# Altium project TestBoard.PrjPcb (part 3 of 5)
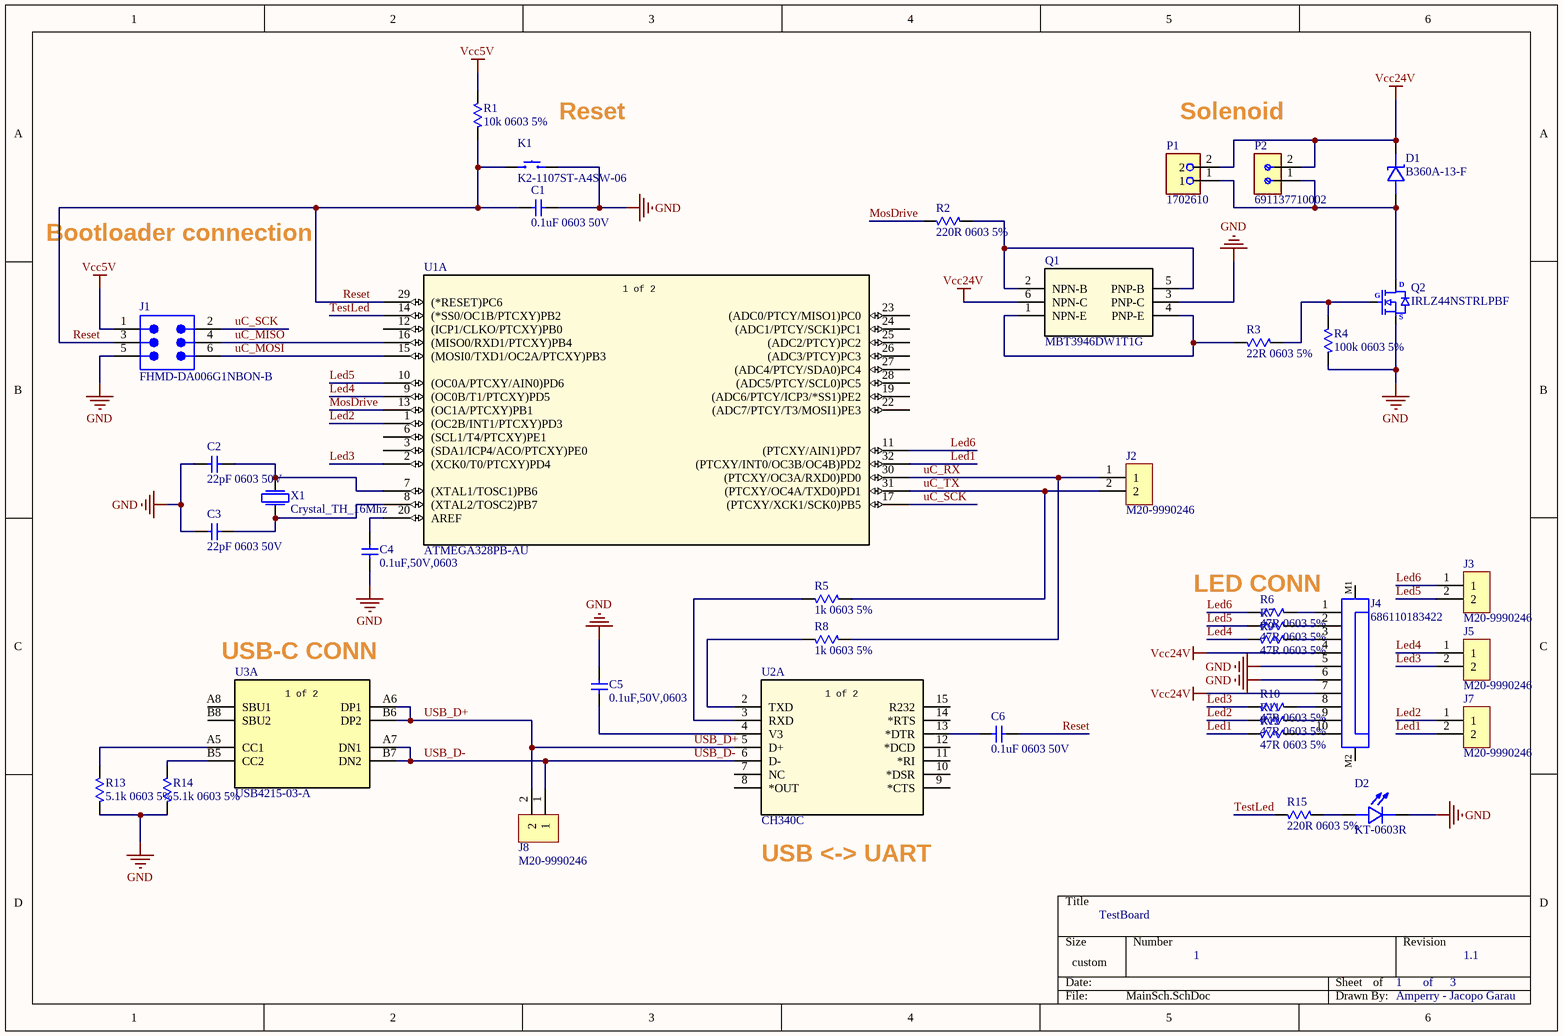
[diagram p4: MainSch.SchDoc]

## Sheet MainSch.SchDoc: TestBoard (continued)

### Library data of the parts (continued)
R4 = CMP-009-00184-2: 100k Ohm 0603 5% Chip Resistor SMD; Manufacturer Part Number: RC0603FR-07100KL; Manufacturer: Yageo Group; Voltage Rating: 75V; Voltage Rating (DC): 50V; Value: 100kO; Temperature Coefficient: 100ppm/°C; Tolerance: 1%; Power Rating: 100mW; ComponentLink12Description: https://datasheet.octopart.com:443/RC0603FR-07100KL-Yageo-Group-datasheet-176638170.pdf?src-supplier=Future+Electronics; ComponentLink6Description: https://datasheet.octopart.com:443/RC0603FR-07100KL-Yageo-datasheet-141265859.pdf?src-supplier=Upverter; ComponentLink2URL: https://datasheet.octopart.com:443/RC0603FR-07100KL-Yageo-datasheet-12596169.pdf?src-supplier=Newark; ComponentLink20Description: https://datasheet.octopart.com:443/RC0603FR-07100KL-Yageo-datasheet-30459151.pdf?src-supplier=Seeed+Studio; Component Type: Standard; China RoHS: Non-Compliant; Length: 1.6mm; ComponentLink5URL: https://datasheet.octopart.com:443/RC0603FR-07100KL-Yageo-datasheet-17842380.pdf?src-supplier=element14+APAC; Design Item ID: RC0603FR-07100KL; ComponentLink21Description: https://datasheet.octopart.com:443/RC0603FR-07100KL-Yageo-datasheet-118562.pdf?src-supplier=DigiKey; ComponentLink15Description: https://datasheet.octopart.com:443/RC0603FR-07100KL-Yageo-datasheet-27584510.pdf?src-supplier=Future+Electronics; ComponentLink11Description: https://datasheet.octopart.com:443/RC0603FR-07100KL-Yageo-datasheet-13691069.pdf?src-supplier=Farnell; Depth: 800µm; ComponentLink11URL: https://datasheet.octopart.com:443/RC0603FR-07100KL-Yageo-datasheet-13691069.pdf?src-supplier=Farnell; ComponentLink13Description: https://datasheet.octopart.com:443/RC0603FR-07100KL-Yageo-datasheet-164759695.pdf?src-supplier=Future+Electronics; Harmonized Tariff Schedule (HTS) Code: 8533.21.00.30; ComponentLink1Description: https://datasheet.octopart.com:443/RC0603FR-07100KL-Yageo-datasheet-175887523.pdf?src-supplier=Newark; Radiation Hardening: No; ComponentLink24URL: http://sigma.octopart.com:80/rohs_statement/Yageo-company-2.pdf?src-supplier=Compliance+Statements; ComponentLink10URL: https://datasheet.octopart.com:443/RC0603FR-07100KL-Yageo-datasheet-62067350.pdf?src-supplier=Farnell; ComponentLink6URL: https://datasheet.octopart.com:443/RC0603FR-07100KL-Yageo-datasheet-141265859.pdf?src-supplier=Upverter; ComponentLink8URL: https://sigma.octopart.com:443/138820526/technical_drawing/Yageo-RC0603FR-07100KL.pdf?src-supplier=Upverter; Composition: Thick Film; Packaging: Tape & Reel; ComponentLink9URL: https://datasheet.octopart.com:443/RC0603FR-07100KL-Yageo-datasheet-98239111.pdf?src-supplier=Upverter; Working Voltage: 75V; ComponentLink19URL: https://datasheet.octopart.com/RC0603FR-07100KL-Yageo-datasheet-73766026.pdf; Number of Terminations: 2; Lifecycle Status: Production; ComponentLink3Description: https://datasheet.octopart.com:443/RC0603FR-07100KL-Yageo-datasheet-34211833.pdf?src-supplier=Newark; JLCPCB Part Number: C14675; Military Standard: Not; ComponentLink23URL: http://sigma.octopart.com:80/conflict_mineral_statement/Yageo-company-3.pdf?src-supplier=Compliance+Statements; Termination: SMD/SMT; ComponentLink24Description: http://sigma.octopart.com:80/rohs_statement/Yageo-company-2.pdf?src-supplier=Compliance+Statements; Mounting Technology: Surface Mount; ComponentLink21URL: https://datasheet.octopart.com:443/RC0603FR-07100KL-Yageo-datasheet-118562.pdf?src-supplier=DigiKey; ComponentLink17URL: https://datasheet.octopart.com:443/RC0603FR-07100KL-Yageo-datasheet-8324193.pdf?src-supplier=Future+Electronics; ComponentLink16Description: https://datasheet.octopart.com:443/RC0603FR-07100KL-Yageo-datasheet-15599030.pdf?src-supplier=Future+Electronics; Pins: 2; ComponentLink18URL: https://datasheet.octopart.com:443/RC0603FR-07100KL-Yageo-datasheet-79472498.pdf?src-supplier=Megastar; Export Control Classification Number (ECCN) Code: EAR99; ComponentLink19Description: https://datasheet.octopart.com/RC0603FR-07100KL-Yageo-datasheet-73766026.pdf; ComponentLink10Description: https://datasheet.octopart.com:443/RC0603FR-07100KL-Yageo-datasheet-62067350.pdf?src-supplier=Farnell; ComponentLink3URL: https://datasheet.octopart.com:443/RC0603FR-07100KL-Yageo-datasheet-34211833.pdf?src-supplier=Newark; Introduction Date: 2004-09-22; Country of Origin: Mainland China, Taiwan; Pin Count: 2; Height: 450µm; ComponentLink8Description: https://sigma.octopart.com:443/138820526/technical_drawing/Yageo-RC0603FR-07100KL.pdf?src-supplier=Upverter; ComponentLink7URL: https://datasheet.octopart.com:443/RC0603FR-07100KL-Yageo-datasheet-103092701.pdf?src-supplier=Upverter; Width: 800µm; ComponentLink18Description: https://datasheet.octopart.com:443/RC0603FR-07100KL-Yageo-datasheet-79472498.pdf?src-supplier=Megastar; Max Operating Temperature: 155°C; RoHS: Compliant; Case Code (Imperial): 0603; ComponentLink13URL: https://datasheet.octopart.com:443/RC0603FR-07100KL-Yageo-datasheet-164759695.pdf?src-supplier=Future+Electronics; ComponentLink1URL: https://datasheet.octopart.com:443/RC0603FR-07100KL-Yageo-datasheet-175887523.pdf?src-supplier=Newark; Number of Terminals: 2; REACH SVHC: Yes; ComponentLink12URL: https://datasheet.octopart.com:443/RC0603FR-07100KL-Yageo-Group-datasheet-176638170.pdf?src-supplier=Future+Electronics; ComponentLink14URL: https://datasheet.octopart.com:443/RC0603FR-07100KL-Yageo-datasheet-137700087.pdf?src-supplier=Future+Electronics; Category: Chip SMD Resistors; ComponentLink4URL: https://datasheet.octopart.com:443/RC0603FR-07100KL-Yageo-datasheet-8328172.pdf?src-supplier=element14+APAC; ComponentLink23Description: http://sigma.octopart.com:80/conflict_mineral_statement/Yageo-company-3.pdf?src-supplier=Compliance+Statements; ComponentLink20URL: https://datasheet.octopart.com:443/RC0603FR-07100KL-Yageo-datasheet-30459151.pdf?src-supplier=Seeed+Studio; Lead Free: Lead Free; ComponentLink16URL: https://datasheet.octopart.com:443/RC0603FR-07100KL-Yageo-datasheet-15599030.pdf?src-supplier=Future+Electronics; ComponentLink14Description: https://datasheet.octopart.com:443/RC0603FR-07100KL-Yageo-datasheet-137700087.pdf?src-supplier=Future+Electronics; Contact Plating: Tin; Source: MySchLib.SchLib; ComponentLink22URL: https://datasheet.octopart.com:443/RC0603FR-07100KL-Yageo-datasheet-503470.pdf?src-supplier=element14; ComponentLink5Description: https://datasheet.octopart.com:443/RC0603FR-07100KL-Yageo-datasheet-17842380.pdf?src-supplier=element14+APAC; ComponentLink7Description: https://datasheet.octopart.com:443/RC0603FR-07100KL-Yageo-datasheet-103092701.pdf?src-supplier=Upverter; ComponentLink4Description: https://datasheet.octopart.com:443/RC0603FR-07100KL-Yageo-datasheet-8328172.pdf?src-supplier=element14+APAC; ComponentLink17Description: https://datasheet.octopart.com:443/RC0603FR-07100KL-Yageo-datasheet-8324193.pdf?src-supplier=Future+Electronics; Min Operating Temperature: -55°C; ComponentLink2Description: https://datasheet.octopart.com:443/RC0603FR-07100KL-Yageo-datasheet-12596169.pdf?src-supplier=Newark; Pricing: 1=0.1, 10=0.024, 25=0.0172, 50=0.0138, 100=0.0112, 250=0.0086, 500=0.00716, 1000=0.00603 (USD); ComponentLink9Description: https://datasheet.octopart.com:443/RC0603FR-07100KL-Yageo-datasheet-98239111.pdf?src-supplier=Upverter; ComponentLink15URL: https://datasheet.octopart.com:443/RC0603FR-07100KL-Yageo-datasheet-27584510.pdf?src-supplier=Future+Electronics; Case/Package: 0603; Case Code (Metric): 0603; Stock: 5166205; ComponentLink22Description: https://datasheet.octopart.com:443/RC0603FR-07100KL-Yageo-datasheet-503470.pdf?src-supplier=element14; Schedule B: 8533210045, 8533210045
R5 R8 = CMP-009-00185-2: 1k 0603 5% Chip Resistor SMD; Manufacturer: Yageo Group; Manufacturer Part Number: RC0603JR-071KL; Power Rating: 100mW; Temperature Coefficient: 100ppm/°C; Value: 1kO; Working Voltage: 75V; Voltage Rating (AC): 50V; ComponentLink6URL: https://datasheet.octopart.com:443/RC0603JR-071KL-Yageo-Group-datasheet-176638170.pdf?src-supplier=Future+Electronics; REACH SVHC: Yes; Source: MySchLib.SchLib; Case/Package: 0603; ComponentLink11URL: https://datasheet.octopart.com:443/RC0603JR-071KL-Yageo-datasheet-15599030.pdf?src-supplier=Future+Electronics; ComponentLink15Description: https://datasheet.octopart.com:443/RC0603JR-071KL-Yageo-datasheet-118562.pdf?src-supplier=DigiKey; ComponentLink7Description: https://datasheet.octopart.com:443/RC0603JR-071KL-Yageo-datasheet-164759695.pdf?src-supplier=Future+Electronics; China RoHS: Non-Compliant; Number of Terminals: 2; Category: Chip SMD Resistors; Component Type: Standard; Min Operating Temperature: -55°C; Packaging: Cut Tape; ComponentLink3Description: https://datasheet.octopart.com:443/RC0603JR-071KL-Yageo-datasheet-8328172.pdf?src-supplier=Upverter; ComponentLink1Description: https://datasheet.octopart.com:443/RC0603JR-071KL-Yageo-datasheet-175887523.pdf?src-supplier=Newark; Pricing: 1=0.1, 10=0.022, 25=0.0156, 50=0.0124, 100=0.010, 250=0.00764, 500=0.00632, 1000=0.00529 (USD); Design Item ID: RC0603JR-071KL; JLCPCB Part Number: C14676; Contact Plating: Tin; ComponentLink8URL: https://datasheet.octopart.com:443/RC0603JR-071KL-Yageo-datasheet-137700087.pdf?src-supplier=Future+Electronics; Mounting Technology: Surface Mount; ComponentLink17URL: http://sigma.octopart.com:80/rohs_statement/Yageo-company-2.pdf?src-supplier=Compliance+Statements; ComponentLink2Description: https://datasheet.octopart.com:443/RC0603JR-071KL-Yageo-datasheet-34211833.pdf?src-supplier=Newark; ComponentLink5URL: https://datasheet.octopart.com:443/RC0603JR-071KL-Yageo-datasheet-62067350.pdf?src-supplier=element14+APAC; ComponentLink4URL: https://datasheet.octopart.com:443/RC0603JR-071KL-Yageo-datasheet-68297981.pdf?src-supplier=Upverter; Tolerance: 5%; Composition: Thick Film; ComponentLink7URL: https://datasheet.octopart.com:443/RC0603JR-071KL-Yageo-datasheet-164759695.pdf?src-supplier=Future+Electronics; ComponentLink8Description: https://datasheet.octopart.com:443/RC0603JR-071KL-Yageo-datasheet-137700087.pdf?src-supplier=Future+Electronics; ComponentLink9Description: https://datasheet.octopart.com:443/RC0603JR071KL-Yageo-datasheet-27584510.pdf?src-supplier=Future+Electronics; ComponentLink12Description: https://datasheet.octopart.com:443/RC0603JR-071KL-Yageo-datasheet-12596169.pdf?src-supplier=Future+Electronics; ComponentLink9URL: https://datasheet.octopart.com:443/RC0603JR071KL-Yageo-datasheet-27584510.pdf?src-supplier=Future+Electronics; Pin Count: 2; Depth: 800µm; ComponentLink6Description: https://datasheet.octopart.com:443/RC0603JR-071KL-Yageo-Group-datasheet-176638170.pdf?src-supplier=Future+Electronics; ComponentLink17Description: http://sigma.octopart.com:80/rohs_statement/Yageo-company-2.pdf?src-supplier=Compliance+Statements; Pins: 2; Military Standard: Not; ComponentLink16Description: http://sigma.octopart.com:80/conflict_mineral_statement/Yageo-company-3.pdf?src-supplier=Compliance+Statements; Lifecycle Status: Production; Termination: SMD/SMT; ComponentLink10URL: https://datasheet.octopart.com:443/RC0603JR-071KL-Yageo-datasheet-17842380.pdf?src-supplier=Future+Electronics; ComponentLink1URL: https://datasheet.octopart.com:443/RC0603JR-071KL-Yageo-datasheet-175887523.pdf?src-supplier=Newark; ComponentLink15URL: https://datasheet.octopart.com:443/RC0603JR-071KL-Yageo-datasheet-118562.pdf?src-supplier=DigiKey; ComponentLink10Description: https://datasheet.octopart.com:443/RC0603JR-071KL-Yageo-datasheet-17842380.pdf?src-supplier=Future+Electronics; RoHS: Compliant; Schedule B: 8533210045, 8533210045; Stock: 607059; ComponentLink12URL: https://datasheet.octopart.com:443/RC0603JR-071KL-Yageo-datasheet-12596169.pdf?src-supplier=Future+Electronics; Max Operating Temperature: 155°C; Radiation Hardening: No; ComponentLink13URL: https://datasheet.octopart.com:443/RC0603JR-071KL-Yageo-datasheet-79472498.pdf?src-supplier=Megastar; ComponentLink4Description: https://datasheet.octopart.com:443/RC0603JR-071KL-Yageo-datasheet-68297981.pdf?src-supplier=Upverter; Height: 450µm; ComponentLink13Description: https://datasheet.octopart.com:443/RC0603JR-071KL-Yageo-datasheet-79472498.pdf?src-supplier=Megastar; ComponentLink14URL: https://datasheet.octopart.com/RC0603JR-071KL-Yageo-datasheet-73766026.pdf; Width: 800µm; Lead Free: Lead Free; ComponentLink5Description: https://datasheet.octopart.com:443/RC0603JR-071KL-Yageo-datasheet-62067350.pdf?src-supplier=element14+APAC; ComponentLink3URL: https://datasheet.octopart.com:443/RC0603JR-071KL-Yageo-datasheet-8328172.pdf?src-supplier=Upverter; ComponentLink16URL: http://sigma.octopart.com:80/conflict_mineral_statement/Yageo-company-3.pdf?src-supplier=Compliance+Statements; ComponentLink11Description: https://datasheet.octopart.com:443/RC0603JR-071KL-Yageo-datasheet-15599030.pdf?src-supplier=Future+Electronics; Length: 1.6mm; Voltage Rating (DC): 50V; ComponentLink2URL: https://datasheet.octopart.com:443/RC0603JR-071KL-Yageo-datasheet-34211833.pdf?src-supplier=Newark; Voltage Rating: 50V; ComponentLink14Description: https://datasheet.octopart.com/RC0603JR-071KL-Yageo-datasheet-73766026.pdf; Case Code (Imperial): 0603
R6 R7 R9-R12 = CMP-009-00183-2: 47 Ohm 0603 5% Chip Resistor SMD; Part Series: Thick Film Chip Resistors; Manufacturer Lifecycle Status: ACTIVE; Manufacturer Part Number: ERJ3GEYJ470V; Manufacturer: Panasonic; Working Voltage: 75V; Value: 47O; Power Rating: 100mW; Temperature Coefficient: 200ppm/°C; Tolerance: 5%; Min Operating Temperature: -55°C; Number of Terminations: 2; ComponentLink10URL: https://datasheet.octopart.com:443/ERJ3GEYJ470V-Panasonic-datasheet-8853621.pdf?src-supplier=Future+Electronics; Pin Count: 2; ComponentLink16URL: https://datasheet.octopart.com:443/ERJ3GEYJ470V-Panasonic-datasheet-27908757.pdf?src-supplier=Electro+Sonic; Schedule B: 8533210045, 8533210045; ComponentLink8URL: https://datasheet.octopart.com:443/ERJ3GEYJ470V-Panasonic-datasheet-5313456.pdf?src-supplier=Future+Electronics; Termination: SMD/SMT; ComponentLink13Description: https://datasheet.octopart.com/ERJ3GEYJ470V-Panasonic-datasheet-78375410.pdf; ComponentLink12Description: https://datasheet.octopart.com:443/ERJ3GEYJ470V-Panasonic-datasheet-138819430.pdf?src-supplier=TME; ComponentLink9URL: https://datasheet.octopart.com:443/ERJ3GEYJ470V-Panasonic-datasheet-10025800.pdf?src-supplier=Future+Electronics; JLCPCB Part Number: C1186; ComponentLink1Description: https://datasheet.octopart.com:443/ERJ3GEYJ470V-Panasonic-datasheet-61114972.pdf?src-supplier=Newark; ComponentLink2URL: https://datasheet.octopart.com:443/ERJ3GEYJ470V-Panasonic-datasheet-136608608.pdf?src-supplier=Newark; ComponentLink11URL: https://datasheet.octopart.com:443/ERJ3GEYJ470V-Panasonic-datasheet-13266541.pdf?src-supplier=Future+Electronics; Component Type: Standard; Category: Chip SMD Resistors; Case Code (Imperial): 0603; ComponentLink14Description: https://datasheet.octopart.com:443/ERJ3GEYJ470V-Panasonic-datasheet-7538305.pdf?src-supplier=Jameco; ComponentLink17URL: https://datasheet.octopart.com:443/ERJ3GEYJ470V-Panasonic-datasheet-37173568.pdf?src-supplier=Electro+Sonic; Lead Free: Lead Free; Harmonized Tariff Schedule (HTS) Code: 8533.21.00.30; ComponentLink6Description: https://datasheet.octopart.com:443/ERJ-3GEYJ470V-Panasonic---ECG-datasheet-15994758.pdf?src-supplier=Farnell; ComponentLink13URL: https://datasheet.octopart.com/ERJ3GEYJ470V-Panasonic-datasheet-78375410.pdf; ComponentLink7Description: https://datasheet.octopart.com:443/ERJ-3GEYJ470V-Panasonic-datasheet-147443676.pdf?src-supplier=Master+Electronics; ComponentLink17Description: https://datasheet.octopart.com:443/ERJ3GEYJ470V-Panasonic-datasheet-37173568.pdf?src-supplier=Electro+Sonic; REACH SVHC: Yes; ComponentLink12URL: https://datasheet.octopart.com:443/ERJ3GEYJ470V-Panasonic-datasheet-138819430.pdf?src-supplier=TME; ComponentLink15Description: https://datasheet.octopart.com:443/ERJ-3GEYJ470V-Panasonic-datasheet-118598.pdf?src-supplier=DigiKey; Voltage Rating (DC): 75V; Contact Plating: Tin; Source: MySchLib.SchLib; ComponentLink9Description: https://datasheet.octopart.com:443/ERJ3GEYJ470V-Panasonic-datasheet-10025800.pdf?src-supplier=Future+Electronics; ComponentLink1URL: https://datasheet.octopart.com:443/ERJ3GEYJ470V-Panasonic-datasheet-61114972.pdf?src-supplier=Newark; Military Standard: Not; Height: 450µm; ComponentLink4Description: https://datasheet.octopart.com:443/ERJ-3GEYJ470V-Panasonic-datasheet-5314550.pdf?src-supplier=Farnell; ComponentLink3URL: https://datasheet.octopart.com:443/ERJ3GEYJ470V-Panasonic-datasheet-13266872.pdf?src-supplier=RS+(Formerly+Allied+Electronics); ComponentLink6URL: https://datasheet.octopart.com:443/ERJ-3GEYJ470V-Panasonic---ECG-datasheet-15994758.pdf?src-supplier=Farnell; Design Item ID: ERJ3GEYJ470V; Features: Automotive AEC-Q200; Case/Package: 0603; Number of Terminals: 2; Width: 800µm; ComponentLink14URL: https://datasheet.octopart.com:443/ERJ3GEYJ470V-Panasonic-datasheet-7538305.pdf?src-supplier=Jameco; ComponentLink7URL: https://datasheet.octopart.com:443/ERJ-3GEYJ470V-Panasonic-datasheet-147443676.pdf?src-supplier=Master+Electronics; Country of Origin: Japan, Mainland China; Composition: Thick Film; Radiation Hardening: No; ComponentLink5URL: https://datasheet.octopart.com:443/ERJ3GEYJ470V-Panasonic-datasheet-10554283.pdf?src-supplier=Farnell; Depth: 800µm; Introduction Date: 1998-09-24; ComponentLink2Description: https://datasheet.octopart.com:443/ERJ3GEYJ470V-Panasonic-datasheet-136608608.pdf?src-supplier=Newark; ComponentLink8Description: https://datasheet.octopart.com:443/ERJ3GEYJ470V-Panasonic-datasheet-5313456.pdf?src-supplier=Future+Electronics; Stock: 122467; ComponentLink16Description: https://datasheet.octopart.com:443/ERJ3GEYJ470V-Panasonic-datasheet-27908757.pdf?src-supplier=Electro+Sonic; Packaging: Cut Tape; ComponentLink15URL: https://datasheet.octopart.com:443/ERJ-3GEYJ470V-Panasonic-datasheet-118598.pdf?src-supplier=DigiKey; Ratings: AEC-Q200; ComponentLink10Description: https://datasheet.octopart.com:443/ERJ3GEYJ470V-Panasonic-datasheet-8853621.pdf?src-supplier=Future+Electronics; Max Power Dissipation: 100mW; RoHS: Compliant; Export Control Classification Number (ECCN) Code: EAR99; ComponentLink4URL: https://datasheet.octopart.com:443/ERJ-3GEYJ470V-Panasonic-datasheet-5314550.pdf?src-supplier=Farnell; Length: 1.6mm; ComponentLink11Description: https://datasheet.octopart.com:443/ERJ3GEYJ470V-Panasonic-datasheet-13266541.pdf?src-supplier=Future+Electronics; ComponentLink5Description: https://datasheet.octopart.com:443/ERJ3GEYJ470V-Panasonic-datasheet-10554283.pdf?src-supplier=Farnell; ComponentLink3Description: https://datasheet.octopart.com:443/ERJ3GEYJ470V-Panasonic-datasheet-13266872.pdf?src-supplier=RS+(Formerly+Allied+Electronics); Voltage Rating: 75V; Lifecycle Status: Production; Mounting Technology: Surface Mount; Pricing: 1=0.1, 10=0.023, 50=0.023, 100=0.019, 1000=0.011, 10000=0.006 (USD); Max Operating Temperature: 155°C
R13 R14 = CMP-009-00186-2: 5.1k Ohm 0603 5% Chip Resistor SMD; Manufacturer: Yageo Group; Manufacturer Part Number: RC0603JR-075K1L; Working Voltage: 75V; Voltage Rating: 50V; Value: 5.1kO; Temperature Coefficient: 100ppm/°C; Power Rating: 100mW; Case/Package: 0603; Lead Free: Lead Free; ComponentLink2URL: https://datasheet.octopart.com:443/RC0603JR-075K1L-Yageo-datasheet-8328172.pdf?src-supplier=Upverter; ComponentLink9Description: https://datasheet.octopart.com:443/RC0603JR-075K1L-Yageo-datasheet-12596169.pdf?src-supplier=Future+Electronics; ComponentLink6URL: https://datasheet.octopart.com:443/RC0603JR-075K1L-Yageo-datasheet-137700087.pdf?src-supplier=Future+Electronics; ComponentLink13Description: https://datasheet.octopart.com/RC0603JR-075K1L-Yageo-datasheet-73766026.pdf; Military Standard: Not; ComponentLink5Description: https://datasheet.octopart.com:443/RC0603JR-075K1L-Yageo-datasheet-127823281.pdf?src-supplier=Future+Electronics; ComponentLink5URL: https://datasheet.octopart.com:443/RC0603JR-075K1L-Yageo-datasheet-127823281.pdf?src-supplier=Future+Electronics; ComponentLink1Description: https://datasheet.octopart.com:443/RC0603JR-075K1L-Yageo-datasheet-175887523.pdf?src-supplier=Newark; ComponentLink3URL: https://datasheet.octopart.com:443/RC0603JR-075K1L-Yageo-Group-datasheet-190305687.pdf?src-supplier=Future+Electronics; Max Operating Temperature: 155°C; ComponentLink11URL: https://datasheet.octopart.com:443/RC0603JR-075K1L-Yageo-datasheet-62067350.pdf?src-supplier=Farnell; Termination: SMD/SMT; ComponentLink10Description: https://datasheet.octopart.com:443/RC0603JR-075K1L-Yageo-datasheet-8324193.pdf?src-supplier=Future+Electronics; Source: MySchLib.SchLib; Schedule B: 8533210045, 8533210045; Case Code (Imperial): 0603; Lifecycle Status: Production; China RoHS: Non-Compliant; ComponentLink4Description: https://datasheet.octopart.com:443/RC0603JR-075K1L-Yageo-datasheet-164759695.pdf?src-supplier=Future+Electronics; Height: 450µm; ComponentLink16Description: http://sigma.octopart.com:80/rohs_statement/Yageo-company-2.pdf?src-supplier=Compliance+Statements; Packaging: Tape & Reel; ComponentLink15URL: http://sigma.octopart.com:80/conflict_mineral_statement/Yageo-company-3.pdf?src-supplier=Compliance+Statements; Mounting Technology: Surface Mount; Pin Count: 2; Tolerance: 5%; ComponentLink1URL: https://datasheet.octopart.com:443/RC0603JR-075K1L-Yageo-datasheet-175887523.pdf?src-supplier=Newark; ComponentLink16URL: http://sigma.octopart.com:80/rohs_statement/Yageo-company-2.pdf?src-supplier=Compliance+Statements; ComponentLink10URL: https://datasheet.octopart.com:443/RC0603JR-075K1L-Yageo-datasheet-8324193.pdf?src-supplier=Future+Electronics; ComponentLink13URL: https://datasheet.octopart.com/RC0603JR-075K1L-Yageo-datasheet-73766026.pdf; Pricing: 1=0.1, 10=0.022, 25=0.0156, 50=0.0124, 100=0.010, 250=0.00764, 500=0.00632, 1000=0.00529 (USD); Length: 1.6mm; ComponentLink4URL: https://datasheet.octopart.com:443/RC0603JR-075K1L-Yageo-datasheet-164759695.pdf?src-supplier=Future+Electronics; REACH SVHC: Yes; Component Type: Standard; ComponentLink3Description: https://datasheet.octopart.com:443/RC0603JR-075K1L-Yageo-Group-datasheet-190305687.pdf?src-supplier=Future+Electronics; Voltage Rating (DC): 50V; Stock: 140039; ComponentLink8Description: https://datasheet.octopart.com:443/RC0603JR-075K1L-Yageo-datasheet-15599030.pdf?src-supplier=Future+Electronics; ComponentLink14URL: https://datasheet.octopart.com:443/RC0603JR-075K1L-Yageo-datasheet-118562.pdf?src-supplier=DigiKey; Design Item ID: RC0603JR-075K1L; Number of Terminals: 2; ComponentLink11Description: https://datasheet.octopart.com:443/RC0603JR-075K1L-Yageo-datasheet-62067350.pdf?src-supplier=Farnell; RoHS: Compliant; ComponentLink8URL: https://datasheet.octopart.com:443/RC0603JR-075K1L-Yageo-datasheet-15599030.pdf?src-supplier=Future+Electronics; Depth: 800µm; ComponentLink12Description: https://datasheet.octopart.com:443/RC0603JR-075K1L-Yageo-datasheet-34211833.pdf?src-supplier=element14+APAC; ComponentLink7URL: https://datasheet.octopart.com:443/RC0603JR-075K1L-Yageo-datasheet-103092701.pdf?src-supplier=Future+Electronics; ComponentLink7Description: https://datasheet.octopart.com:443/RC0603JR-075K1L-Yageo-datasheet-103092701.pdf?src-supplier=Future+Electronics; ComponentLink2Description: https://datasheet.octopart.com:443/RC0603JR-075K1L-Yageo-datasheet-8328172.pdf?src-supplier=Upverter; Composition: Thick Film; ComponentLink14Description: https://datasheet.octopart.com:443/RC0603JR-075K1L-Yageo-datasheet-118562.pdf?src-supplier=DigiKey; ComponentLink9URL: https://datasheet.octopart.com:443/RC0603JR-075K1L-Yageo-datasheet-12596169.pdf?src-supplier=Future+Electronics; Category: Chip SMD Resistors; JLCPCB Part Number: C14677; Width: 800µm; ComponentLink15Description: http://sigma.octopart.com:80/conflict_mineral_statement/Yageo-company-3.pdf?src-supplier=Compliance+Statements; Pins: 2; Min Operating Temperature: -55°C; ComponentLink6Description: https://datasheet.octopart.com:443/RC0603JR-075K1L-Yageo-datasheet-137700087.pdf?src-supplier=Future+Electronics; ComponentLink12URL: https://datasheet.octopart.com:443/RC0603JR-075K1L-Yageo-datasheet-34211833.pdf?src-supplier=element14+APAC
U1 = CMP-036-000083-3: Manufacturer_Name: Microchip; Type: Type; Copyright: Copyright (C) 2025 Ultra Librarian. All rights reserved.; Design Item ID: ATMEGA328PB-AU_1; Manufacturer_Part_Number: ATMEGA328PB-AU; JLCPCB Part Number: C618731; RefDes: RefDes; Source: MySchLib.SchLib; Component Type: Standard; Pin Count: 32; PartId: 1
U2 = CMP-031-000005-2: USB to UART Serial Converter; JLCPCB Part Number: C84681; Component Type: Standard; Design Item ID: CH340C; Source: MySchLib.SchLib; Pin Count: 16; PartId: 1
U3 = CMP-036-000093-2: USB-C, 12+4 Contacts 16POS Rohs Compliant: Yes; Manufacturer: Global Connector Technology; Manufacturer Part Number: USB4215-03-A; Source: MySchLib.SchLib; ComponentLink1URL: https://datasheet.octopart.com:443/USB4215-03-A-GCT-datasheet-188869092.pdf?src-supplier=TME; ComponentLink2Description: https://datasheet.octopart.com:443/USB4215-03-A-GCT-datasheet-188936008.pdf?src-supplier=TME; Category: USB Connectors; ComponentLink2URL: https://datasheet.octopart.com:443/USB4215-03-A-GCT-datasheet-188936008.pdf?src-supplier=TME; Orientation: Horizontal; Design Item ID: USB4215-03-A; Pins: 16; JLCPCB Part Number: C165948; Component Type: Standard; Pin Count: 16; Pricing: 1=0.53, 10=0.449, 25=0.4208, 50=0.4006, 100=0.3814, 250=0.35752, 500=0.34044 (USD); Stock: 1071; ComponentLink1Description: https://datasheet.octopart.com:443/USB4215-03-A-GCT-datasheet-188869092.pdf?src-supplier=TME; PartId: 1
X1 = CMP-003-00030-2: Crystal, 16Mhz, Th, 11.05mm X 4.7mm Rohs Compliant; Manufacturer: Wurth Elektronik; Manufacturer Part Number: 830058383B; Pin Length: 13.2mm; Min Operating Temperature: -40°C; Max Operating Temperature: 85°C; Stock: 374; Pricing: 1=0.5, 10=0.419, 50=0.377, 100=0.336 (USD); Pin Count: 2; Length: 11.05mm; ComponentLink1URL: https://datasheet.octopart.com:443/830058383B-Wurth-Elektronik-datasheet-168504253.pdf?src-supplier=Wurth+Elektronik; ComponentLink1Description: https://datasheet.octopart.com:443/830058383B-Wurth-Elektronik-datasheet-168504253.pdf?src-supplier=Wurth+Elektronik; Frequency: 16MHz; Source: MySchLib.SchLib; JLCPCB Part Number: C6412216; Width: 4.7mm; Category: Crystals; Component Type: Standard; Design Item ID: Crystal_TH; Height: 4mm